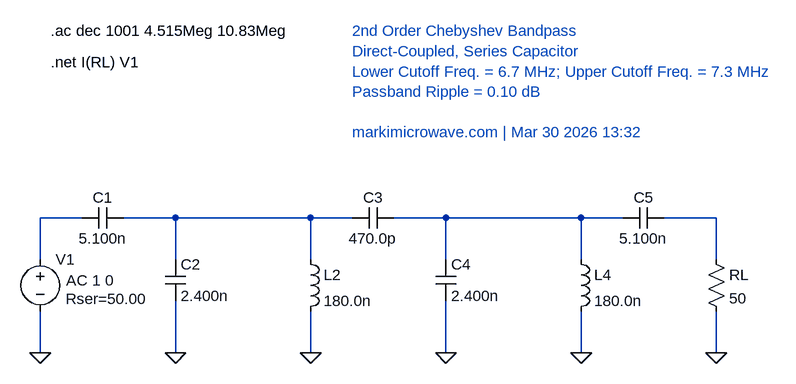
[diagram p0: schematic BPF.asc]
BPF.asc, the LTspice schematic file:
Version 4
SHEET 1 1200 400
WIRE 0 0 0 64
WIRE 0 144 0 208
WIRE 0 0 64 0
WIRE 128 0 208 0
WIRE 208 0 208 64
WIRE 208 128 208 208
WIRE 208 0 416 0
WIRE 416 0 416 64
WIRE 416 144 416 208
WIRE 416 0 480 0
WIRE 544 0 624 0
WIRE 624 0 624 64
WIRE 624 128 624 208
WIRE 624 0 832 0
WIRE 832 0 832 64
WIRE 832 144 832 208
WIRE 832 0 896 0
WIRE 960 0 1040 0
WIRE 1040 0 1040 64
WIRE 1040 144 1040 208
FLAG 0 208 0
FLAG 208 208 0
FLAG 416 208 0
FLAG 624 208 0
FLAG 832 208 0
FLAG 1040 208 0
SYMBOL voltage 0 48 R0
WINDOW 123 40 48 Left 2
WINDOW 39 39 77 Left 2
SYMATTR InstName V1
SYMATTR Value ""
SYMATTR Value2 AC 1 0
SYMATTR SpiceLine Rser=50.00
SYMBOL cap 64 16 R270
SYMATTR InstName C1
SYMATTR Value 5.100n
WINDOW 0 32 32 VTop 2
WINDOW 3 0 32 VBottom 2
SYMBOL cap 192 64 R0
SYMATTR InstName C2
SYMATTR Value 2.400n
SYMBOL ind 400 48 R0
SYMATTR InstName L2
SYMATTR Value 180.0n
SYMBOL cap 480 16 R270
SYMATTR InstName C3
SYMATTR Value 470.0p
WINDOW 0 32 32 VTop 2
WINDOW 3 0 32 VBottom 2
SYMBOL cap 608 64 R0
SYMATTR InstName C4
SYMATTR Value 2.400n
SYMBOL ind 816 48 R0
SYMATTR InstName L4
SYMATTR Value 180.0n
SYMBOL cap 896 16 R270
SYMATTR InstName C5
SYMATTR Value 5.100n
WINDOW 0 32 32 VTop 2
WINDOW 3 0 32 VBottom 2
SYMBOL res 1024 48 R0
SYMATTR InstName RL
SYMATTR Value 50
TEXT 16 -288 Left 2 !.ac dec 1001 4.515Meg 10.83Meg
TEXT 16 -240 Left 2 !.net I(RL) V1
TEXT 480 -288 Left 2 ;2nd Order Chebyshev Bandpass\nDirect-Coupled, Series Capacitor\nLower Cutoff Freq. = 6.7 MHz; Upper Cutoff Freq. = 7.3 MHz\nPassband Ripple = 0.10 dB\n\nmarkimicrowave.com | Mar 30 2026 13:32

The netlist it stands for:
* BPF.asc
V1 N001 0 AC 1 0 Rser=50.00
C1 N001 N002 5.100n
C2 N002 0 2.400n
L2 N002 0 180.0n
C3 N002 N003 470.0p
C4 N003 0 2.400n
L4 N003 0 180.0n
C5 N003 N004 5.100n
RL N004 0 50
.ac dec 1001 4.515Meg 10.83Meg
.net I(RL) V1
* 2nd Order Chebyshev Bandpass
* Direct-Coupled, Series Capacitor
* Lower Cutoff Freq. = 6.7 MHz; Upper Cutoff Freq. = 7.3 MHz
* Passband Ripple = 0.10 dB
* markimicrowave.com | Mar 30 2026 13:32
.backanno
.end